# Altium schematic sheet wifi.SchDoc
size A4; DrawnBy: Van Tuan Ngo; Organization: PIF Club; Address1: 304B1, HCMUT,; Address2: Ly Thuong Kiet St.,; Address3: District 10, HCM, VN; DocumentNumber: 6; Revision: 1.0.0; SheetNumber: 6; SheetTotal: 8; Project: PIFWRobot
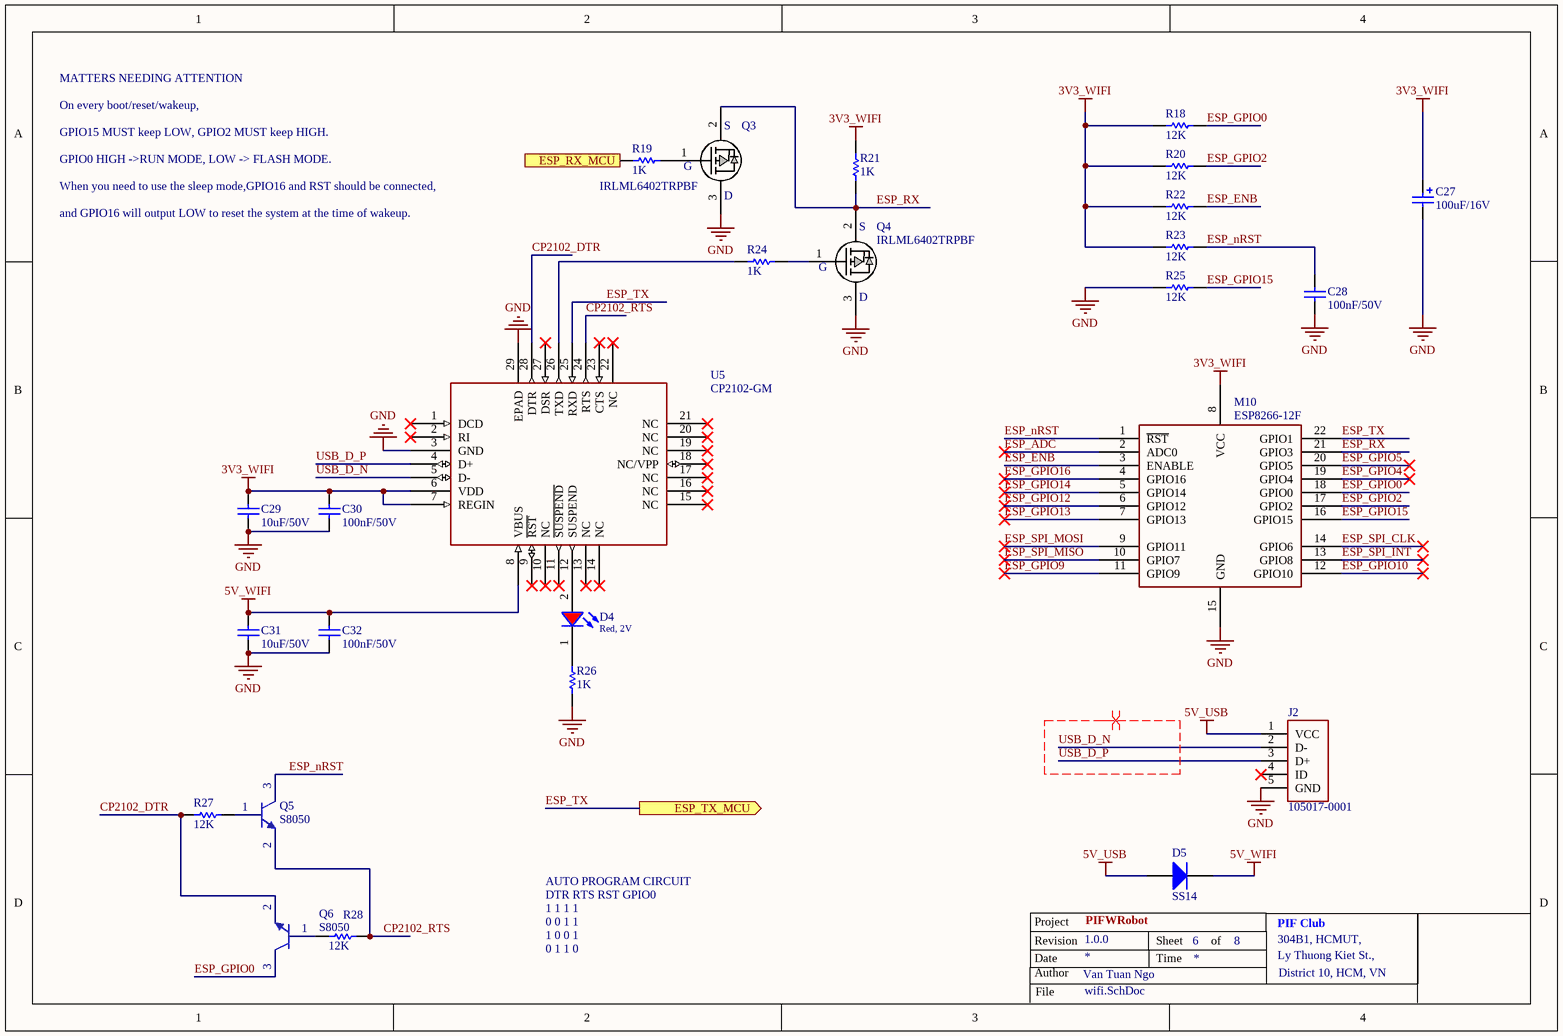
[diagram p0: wifi.SchDoc]

## Parts
C27  value 100uF/16V  [CAP_SM_TAN]  (hidden comment: TAJB107M006RNJ)
C28  value 100nF/50V  [CAP-SM-0805]  (hidden comment: Cap-100nF-50V-0805)
C29  value 10uF/50V  [CAP-SM-0805]  (hidden comment: Cap-10uF-50V-0805)
C30  value 100nF/50V  [CAP-SM-0805]  (hidden comment: Cap-100nF-50V-0805)
C31  value 10uF/50V  [CAP-SM-0805]  (hidden comment: Cap-10uF-50V-0805)
C32  value 100nF/50V  [CAP-SM-0805]  (hidden comment: Cap-100nF-50V-0805)
D4  Red, 2V  [WL-SMCW_0805]
D5  SS14  [SS14]
J2  105017-0001  [CONN_105017-0001]
M10  ESP8266-12F  [ESP8266-12F]
Q3  IRLML6402TRPBF  [SOT23_NEX]
Q4  IRLML6402TRPBF  [SOT23_NEX]
Q5  S8050  [SOT23_NEX]
Q6  S8050  [SOT23_NEX]
R18  value 12K  [RES-SM-0805]  (hidden comment: Res-12K-0805)
R19  value 1K  [RES-SM-0805]  (hidden comment: Res-1K-0805)
R20  value 12K  [RES-SM-0805]  (hidden comment: Res-12K-0805)
R21  value 1K  [RES-SM-0805]  (hidden comment: Res-1K-0805)
R22  value 12K  [RES-SM-0805]  (hidden comment: Res-12K-0805)
R23  value 12K  [RES-SM-0805]  (hidden comment: Res-12K-0805)
R24  value 1K  [RES-SM-0805]  (hidden comment: Res-1K-0805)
R25  value 12K  [RES-SM-0805]  (hidden comment: Res-12K-0805)
R26  value 1K  [RES-SM-0805]  (hidden comment: Res-1K-0805)
R27  value 12K  [RES-SM-0805]  (hidden comment: Res-12K-0805)
R28  value 12K  [RES-SM-0805]  (hidden comment: Res-12K-0805)
U5  CP2102-GM  [QFN28_5X5_SIL]

## Ports
ESP_RX_MCU (in), ESP_TX_MCU (out)

## Nets
3V3_WIFI: C27.1 C29.2 C30.2 M10.8(VCC) R18.1 R20.1 R21.2 R22.1 R23.1 U5.6(VDD) U5.7(REGIN)
5V_USB: D5.2(A) J2.1(VCC)
5V_WIFI: C31.2 C32.2 D5.1(K) U5.8(VBUS)
GND: C27.2 C28.1 C29.1 C30.1 C31.1 C32.1 J2.5(GND) M10.15(GND) Q3.3(D) Q4.3(D) R25.1 R26.2 U5.3(GND) U5.29(EPAD)
CP2102_DTR: Q6.2(E) R27.1 U5.28(DTR)
CP2102_RTS: Q5.2(E) R28.2 U5.24(RTS)
ESP_ADC: M10.2(ADC0)
ESP_ENB: M10.3(ENABLE) R22.2
ESP_GPIO0: M10.18(GPIO0) Q6.3(C) R18.2
ESP_GPIO2: M10.17(GPIO2) R20.2
ESP_GPIO4: M10.19(GPIO4)
ESP_GPIO5: M10.20(GPIO5)
ESP_GPIO9: M10.11(GPIO9)
ESP_GPIO10: M10.12(GPIO10)
ESP_GPIO12: M10.6(GPIO12)
ESP_GPIO13: M10.7(GPIO13)
ESP_GPIO14: M10.5(GPIO14)
ESP_GPIO15: M10.16(GPIO15) R25.2
ESP_GPIO16: M10.4(GPIO16)
ESP_nRST: C28.2 M10.1(~{RST}) Q5.3(C) R23.2
ESP_RX: M10.21(GPIO3) Q3.2(S) Q4.2(S) R21.1
ESP_RX_MCU: R19.1 ; port ESP_RX_MCU
ESP_SPI_CLK: M10.14(GPIO6)
ESP_SPI_INT: M10.13(GPIO8)
ESP_SPI_MISO: M10.10(GPIO7)
ESP_SPI_MOSI: M10.9(GPIO11)
ESP_TX: M10.22(GPIO1) U5.25(RXD) ; port ESP_TX_MCU
USB_D_N: J2.2(D-) U5.5(D-)
USB_D_P: J2.3(D+) U5.4(D+)
NetD4_1: D4.1(K) R26.1
NetD4_2: D4.2(A) U5.12(SUSPEND)
NetQ3_1: Q3.1(G) R19.2
NetQ4_1: Q4.1(G) R24.2
NetQ5_1: Q5.1(B) R27.2
NetQ6_1: Q6.1(B) R28.1
NetR24_1: R24.1 U5.26(TXD)

Not connected (* = marked no-connect by the designer): J2 4(ID)*; U5 1(DCD)* 2(RI)* 9(~{RST})* 10(NC)* 11(~{SUSPEND})* 13(NC)* 14(NC)* 15(NC)* 16(NC)* 17(NC)* 18(NC/VPP)* 19(NC)* 20(NC)* 21(NC)* 22(NC)* 23(CTS)* 27(DSR)*

## Layout directives
differential pair: USB_D_N, USB_D_P

## Notes on the sheet
- MATTERS NEEDING ATTENTION
- On every boot/reset/wakeup,
- GPIO15 MUST keep LOW, GPIO2 MUST keep HIGH.
- GPIO0 HIGH ->RUN MODE, LOW -> FLASH MODE.
- When you need to use the sleep mode,GPIO16 and RST should be connected,
- and GPIO16 will output LOW to reset the system at the time of wakeup.
- AUTO PROGRAM CIRCUIT
- DTR RTS RST GPIO0
- 1 1 1 1
- 0 0 1 1
- 1 0 0 1
- 0 1 1 0
- Project
- Revision
- Date
- Author
- Sheet
- Time
- of
- File

## Library data of the parts
C27 = Cap-Tan-100uF-16V: Manufacturer: Nichicon; Manufacturer Part Number: UWX1C101MCL1GB; Local Supplier: thegioiic; Local Supplier Link: https://www.thegioiic.com/products/tu-tantalum-100uf-16v-2312-tajc107k016rnj; Supplier 1: Digikey; Supplier 1 Part Number: 493-2105-1-ND; Supplier 1 Link: https://www.digikey.com/product-detail/en/nichicon/UWX1C101MCL1GB/493-2105-1-ND/590080
C28 C30 C32 = Cap-100nF-50V-0805: CAP CER 0.1UF 50V Y5V 0805; Manufacturer: Samsung Electro-Mechanics; Manufacturer Part Number: CL21F104ZBCNNNC; Local Supplier: thegioiic; Local Supplier Link: https://thegioiic.com/products/tu-100nf-0-1uf-50v-0805; Supplier 1: Digikey; Supplier 1 Part Number: 1276-1007-1-ND; Supplier 1 Link: https://www.digikey.com/product-detail/en/samsung-electro-mechanics/CL21F104ZBCNNNC/1276-1007-1-ND/3889093
C29 C31 = Cap-10uF-50V-0805: CAP CER 10UF 50V X5R 0805; Manufacturer: Yageo; Manufacturer Part Number: CC0805KKX5R9BB106; Local Supplier: thegioiic; Local Supplier Link: https://www.thegioiic.com/products/tu-gom-0805-10uf-50v; Supplier 1: Digikey; Supplier 1 Link: https://www.digikey.com/product-detail/en/yageo/CC0805KKX5R9BB106/311-3499-2-ND/7164383; Supplier 1 Part Number: 311-3499-2-ND
D4 = 0805-Red: WL-SMCW SMT Mono-color Chip LED Waterclear, size 0805, Red, 2V, 140deg; Part Number: 150080RS75000; Chip Technology: AlInGaP; Dominant Wavelength typ.: 625nm; Luminous Intensity typ.: 150mcd; Peak Wavelength typ.: 630nm; Viewing Angle: 140deg; ComponentLink1Description: Manufacturer; ComponentLink1URL: http://www.we-online.de; ComponentLink2URL: https://www.we-online.com/catalog/datasheet/150080RS75000.pdf; ComponentLink2Description: Datasheet; Forward Voltage typ.: 2V; Emitting Color: Red; Mounting Technology: SMT; Operating Temperature: -40 to +85degC; Published Date: December 2019; Packaging: Tape and Reel; Size: 0805; Publisher: Wurth Elektronik; Local Supplier: thegioiic; Local Supplier Partnumber: x; Local Supplier Link: https://www.thegioiic.com/products/led-do-0805-dan-smd-trong-suot-harvatek
D5 = Diode-SS14: DIODE SCHOTTKY 40V 1A SMA; Manufacturer: ON Semiconductor; Local Supplier: thegioiic; Local Supplier Link: https://www.thegioiic.com/products/ss14-sma-diode-schottky-1a-1n5819; Supplier 1: Digikey; Supplier 1 Link: https://www.digikey.com/product-detail/en/on-semiconductor/SS14/SS14CT-ND/965729; Manufacturer Part Number: SS14; Supplier 1 Part Number: SS14CT-ND
J2 = 105017-0001: CONN RCPT USB2.0 MICRO B SMD R/A; Vendor: Molex Connector Corporation; Built_By: EMA_Cory; SourceLibrary: Molex_2020-05-26; Datasheet: https://www.molex.com/pdm_docs/sd/1050170001_sd.pdf; Manufacturer_Part_Number: 105017-0001; Copyright: Copyright (C) 2018 Accelerated Designs. All rights reserved; RefDes: RefDes; Type: DEV; Local Supplier: thegioiic; Local Supplier Part Number: x; Local Supplier Link: https://www.thegioiic.com/products/cong-usb-micro-b-2-0-dau-cai-5-chan-smd-v1
Q3 Q4 = IRLML6402TRPBF: P-Channel 20V 3.7A (Ta) 1.3W (Ta) Surface Mount Micro3™/SOT-23; Local Supplier: thegioiic; Local Supplier Link: https://www.thegioiic.com/products/irlml6402trpbf; Local Supplier Part Number: *
R18 R20 R22 R23 R25 R27 R28 = Res-12K-0805: RES 12 KOHM JUMPER 0805; Manufacturer: Vishay Thin Film; Manufacturer Part Number: PAT0805E3121BST1; Local Supplier: icdayroi; Local Supplier Link: https://icdayroi.com/dien-tro-12k-0805-1-goi-50-con; Supplier 1: Digikey; Supplier 1 Link: https://www.digikey.com/product-detail/en/vishay-thin-film/PAT0805E3121BST1/PAT0805E3121BST1-ND/2281536; Supplier 1 Part Number: PAT0805E3121BST1-ND
R19 R21 R24 R26 = Res-1K-0805: RES 1K OHM 1% 1/4W 0805; Manufacturer: Stackpole Electronics Inc; Manufacturer Part Number: RNCP0805FTD1K00; Local Supplier: thegioiic; Local Supplier Link: https://www.thegioiic.com/products/dien-tro-1-kohm-0805-5; Supplier 1: Digikey; Supplier 1 Link: https://www.digikey.com/product-detail/en/stackpole-electronics-inc/RNCP0805FTD1K00/RNCP0805FTD1K00CT-ND/2240568; Supplier 1 Part Number: RNCP0805FTD1K00CT-ND
U5 = CP2102-GM: Vendor: Silicon Labs; Built_By: EMA_UL_Team; SourceLibrary: Silicon_Labs_2015-03-23; Manufacturer_Part_Number: CP2102-GM; Copyright: Copyright (C) 2018 Accelerated Designs. All rights reserved; RefDes: RefDes; Type: DEV; Local Supplier: thegioiic; Local Supplier Part Number: *; Local Supplier Link: https://www.thegioiic.com/products/cp2102
M10 = ESP8266-12F: Manufacturer: *; Manufacturer Part Number: *; Local Supplier: thegioiic; Local Supplier Link: https://www.thegioiic.com/products/esp-12f-esp8266-mach-thu-phat-wifi; Local Supplier Part Number: x
Q5 Q6 = S8050: Local Supplier: thegioiic; Local Supplier Part Number: *; Local Supplier Link: https://www.thegioiic.com/products/mmss8050-h-tp